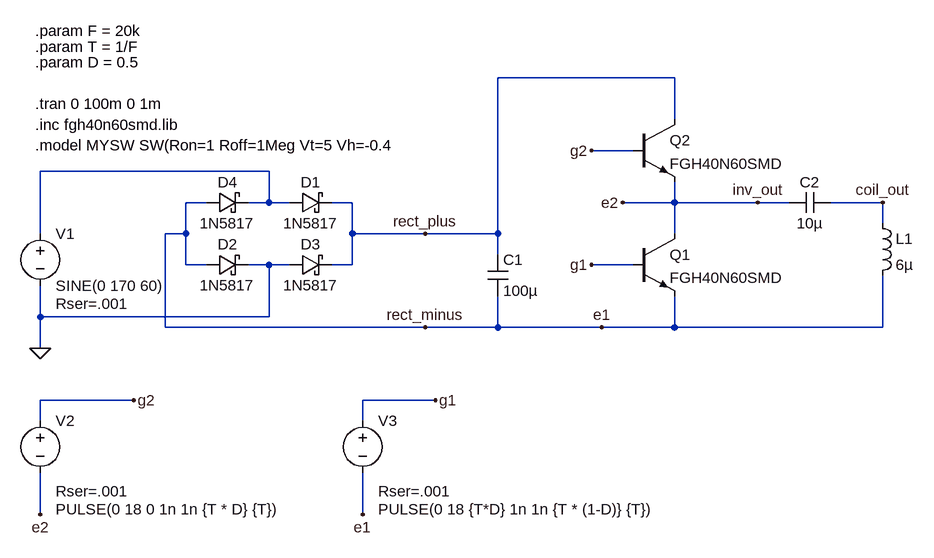
[diagram p0: schematic final_schem.asc]
final_schem.asc, the LTspice schematic file:
Version 4
SHEET 1 1476 680
WIRE 1024 -144 752 -144
WIRE 1024 -80 1024 -144
WIRE 960 -32 896 -32
WIRE 400 0 48 0
WIRE 304 48 272 48
WIRE 400 48 400 0
WIRE 400 48 368 48
WIRE 432 48 400 48
WIRE 528 48 496 48
WIRE 1024 48 1024 16
WIRE 1024 48 944 48
WIRE 1152 48 1024 48
WIRE 1200 48 1152 48
WIRE 1344 48 1264 48
WIRE 1344 80 1344 48
WIRE 48 96 48 0
WIRE 272 96 272 48
WIRE 272 96 240 96
WIRE 528 96 528 48
WIRE 640 96 528 96
WIRE 752 96 752 -144
WIRE 752 96 640 96
WIRE 1024 96 1024 48
WIRE 752 128 752 96
WIRE 272 144 272 96
WIRE 304 144 272 144
WIRE 400 144 368 144
WIRE 432 144 400 144
WIRE 528 144 528 96
WIRE 528 144 496 144
WIRE 960 144 896 144
WIRE 48 224 48 176
WIRE 400 224 400 144
WIRE 400 224 48 224
WIRE 240 240 240 96
WIRE 640 240 240 240
WIRE 752 240 752 192
WIRE 752 240 640 240
WIRE 912 240 752 240
WIRE 1024 240 1024 192
WIRE 1024 240 912 240
WIRE 1344 240 1344 160
WIRE 1344 240 1024 240
WIRE 48 272 48 224
WIRE 192 352 48 352
WIRE 656 352 544 352
WIRE 48 384 48 352
WIRE 544 384 544 352
WIRE 48 528 48 464
WIRE 544 528 544 464
FLAG 48 272 0
FLAG 640 96 rect_plus
FLAG 896 -32 g2
FLAG 896 144 g1
FLAG 192 352 g2
FLAG 656 352 g1
FLAG 1152 48 inv_out
FLAG 944 48 e2
FLAG 1344 48 coil_out
FLAG 640 240 rect_minus
FLAG 912 240 e1
FLAG 544 528 e1
FLAG 48 528 e2
SYMBOL voltage 48 80 R0
WINDOW 123 0 0 Left 0
WINDOW 39 24 124 Left 2
SYMATTR SpiceLine Rser=.001
SYMATTR InstName V1
SYMATTR Value SINE(0 170 60)
SYMBOL schottky 432 64 R270
WINDOW 0 32 32 VTop 2
WINDOW 3 0 32 VBottom 2
SYMATTR InstName D1
SYMATTR Value 1N5817
SYMATTR Description Diode
SYMATTR Type diode
SYMBOL schottky 304 160 R270
WINDOW 0 32 32 VTop 2
WINDOW 3 0 32 VBottom 2
SYMATTR InstName D2
SYMATTR Value 1N5817
SYMATTR Description Diode
SYMATTR Type diode
SYMBOL schottky 432 160 R270
WINDOW 0 32 32 VTop 2
WINDOW 3 0 32 VBottom 2
SYMATTR InstName D3
SYMATTR Value 1N5817
SYMATTR Description Diode
SYMATTR Type diode
SYMBOL schottky 304 64 R270
WINDOW 0 32 32 VTop 2
WINDOW 3 0 32 VBottom 2
SYMATTR InstName D4
SYMATTR Value 1N5817
SYMATTR Description Diode
SYMATTR Type diode
SYMBOL cap 736 128 R0
SYMATTR InstName C1
SYMATTR Value 100µ
SYMBOL cap 1264 32 R90
WINDOW 0 0 32 VBottom 2
WINDOW 3 32 32 VTop 2
SYMATTR InstName C2
SYMATTR Value 10µ
SYMBOL ind 1328 64 R0
SYMATTR InstName L1
SYMATTR Value 6µ
SYMATTR SpiceLine Rser=7
SYMBOL voltage 48 368 R0
WINDOW 3 24 152 Left 2
WINDOW 123 0 0 Left 0
WINDOW 39 24 124 Left 2
SYMATTR Value PULSE(0 18 0 1n 1n {T * D} {T})
SYMATTR SpiceLine Rser=.001
SYMATTR InstName V2
SYMBOL voltage 544 368 R0
WINDOW 3 24 152 Left 2
WINDOW 123 0 0 Left 0
WINDOW 39 24 124 Left 2
SYMATTR Value PULSE(0 18 {T*D} 1n 1n {T * (1-D)} {T})
SYMATTR SpiceLine Rser=.001
SYMATTR InstName V3
SYMBOL npn 960 96 R0
SYMATTR InstName Q1
SYMATTR Value FGH40N60SMD
SYMATTR Prefix X
SYMBOL npn 960 -80 R0
SYMATTR InstName Q2
SYMATTR Value FGH40N60SMD
SYMATTR Prefix X
TEXT 40 -72 Left 2 !.inc fgh40n60smd.lib
TEXT 40 -104 Left 2 !.tran 0 100m 0 1m
TEXT 40 -192 Left 2 !.param T = 1/F
TEXT 40 -216 Left 2 !.param F = 20k
TEXT 40 -168 Left 2 !.param D = 0.5
TEXT 40 -40 Left 2 !.model MYSW SW(Ron=1 Roff=1Meg Vt=5 Vh=-0.4

The netlist it stands for:
* final_schem.asc
V1 N001 0 SINE(0 170 60) Rser=.001
D1 N001 rect_plus 1N5817
D2 e1 0 1N5817
D3 0 rect_plus 1N5817
D4 e1 N001 1N5817
C1 rect_plus e1 100µ
C2 coil_out e2 10µ
L1 coil_out e1 6µ Rser=7
V2 g2 e2 PULSE(0 18 0 1n 1n {T * D} {T}) Rser=.001
V3 g1 e1 PULSE(0 18 {T*D} 1n 1n {T * (1-D)} {T}) Rser=.001
XQ1 e2 g1 e1 FGH40N60SMD  ; pins C B E
XQ2 rect_plus g2 e2 FGH40N60SMD  ; pins C B E
.model D D
.lib standard.dio
.inc fgh40n60smd.lib
.tran 0 100m 0 1m
.param T = 1/F
.param F = 20k
.param D = 0.5
.model MYSW SW(Ron=1 Roff=1Meg Vt=5 Vh=-0.4
.backanno
.end